# EasyEDA Pro project Frogduino R2 EasyedaPro.epro

# Board PCB6
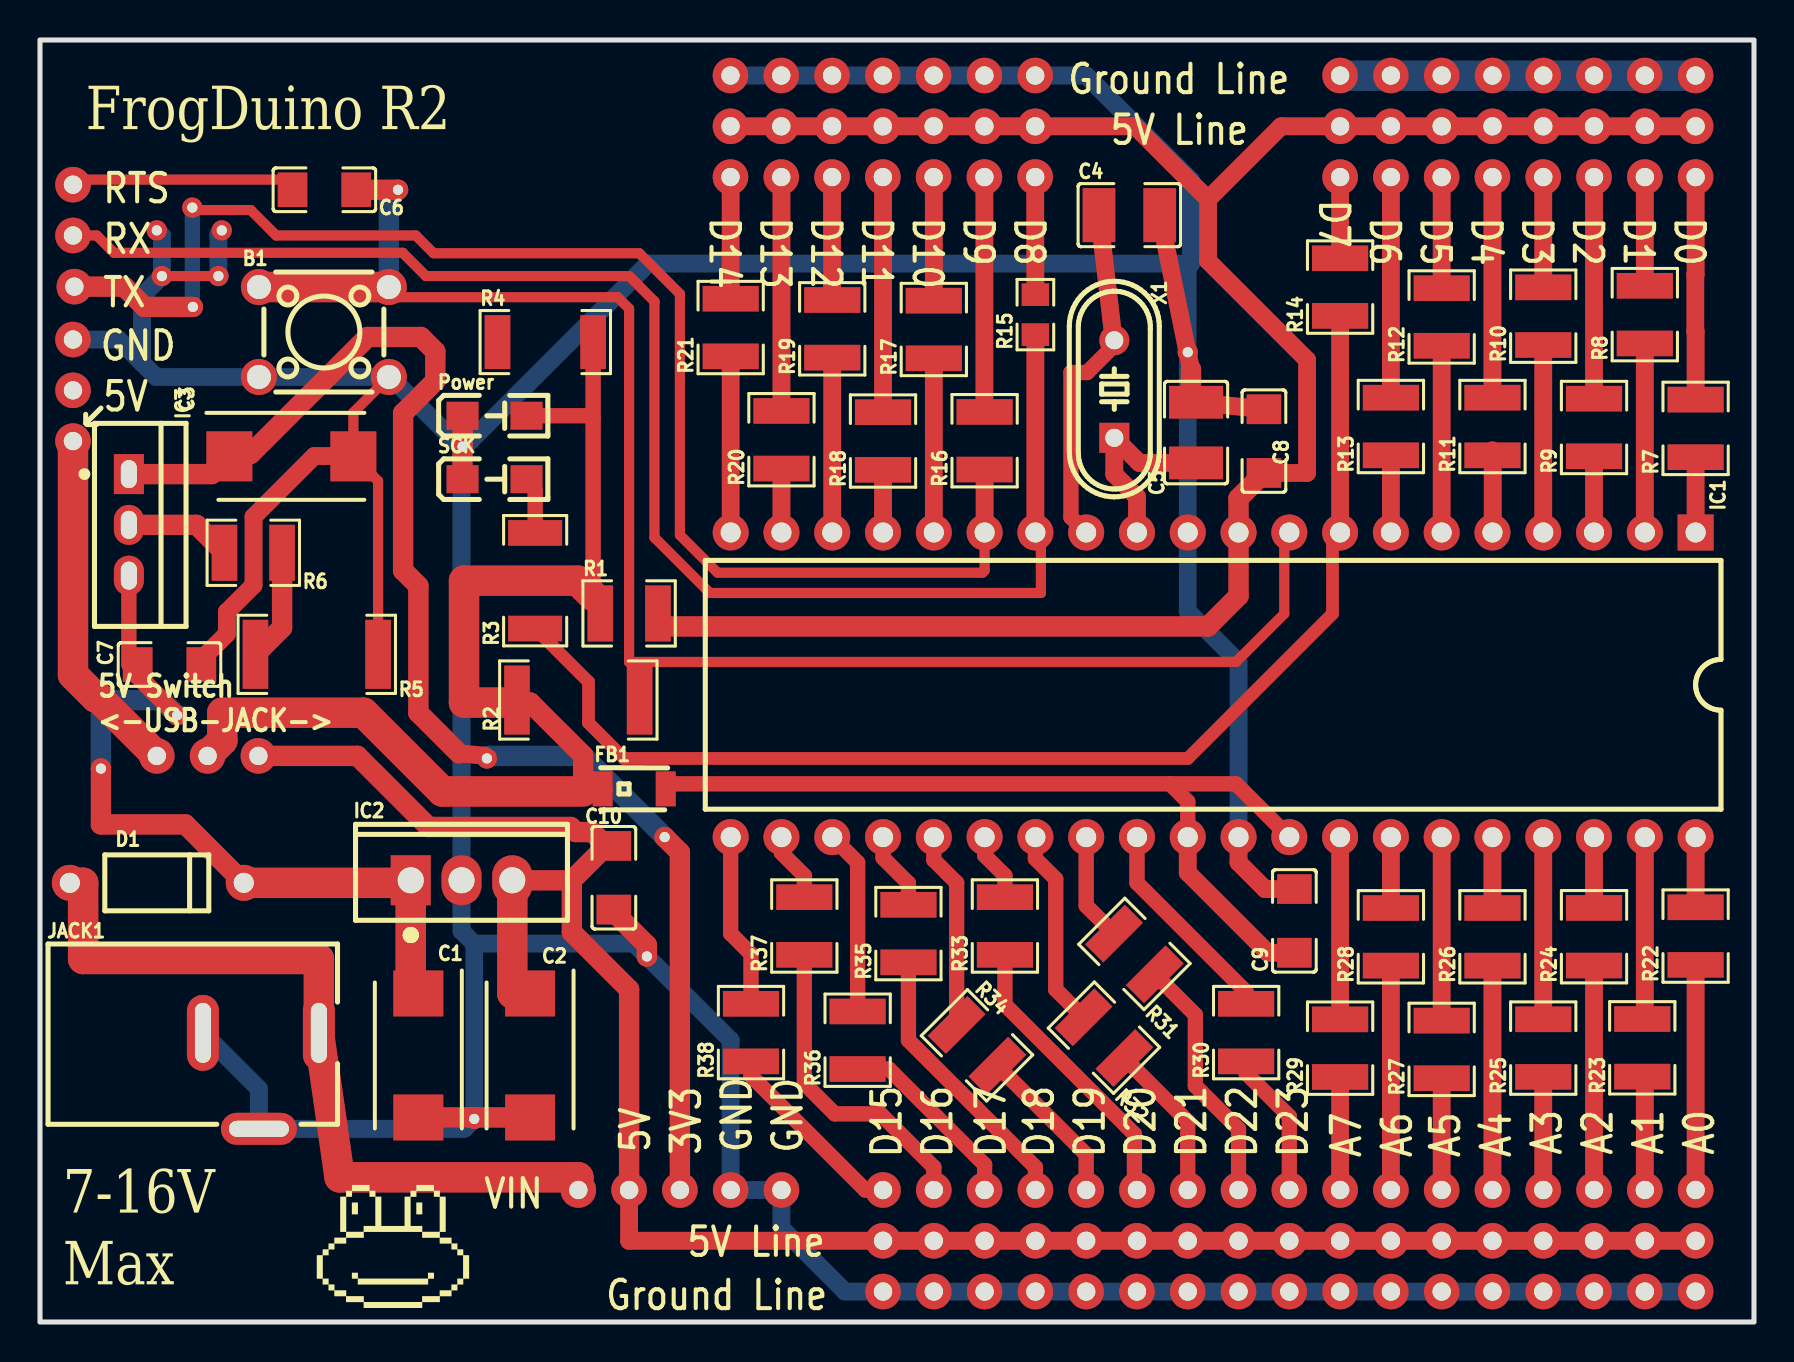
[diagram p0: board, top side]
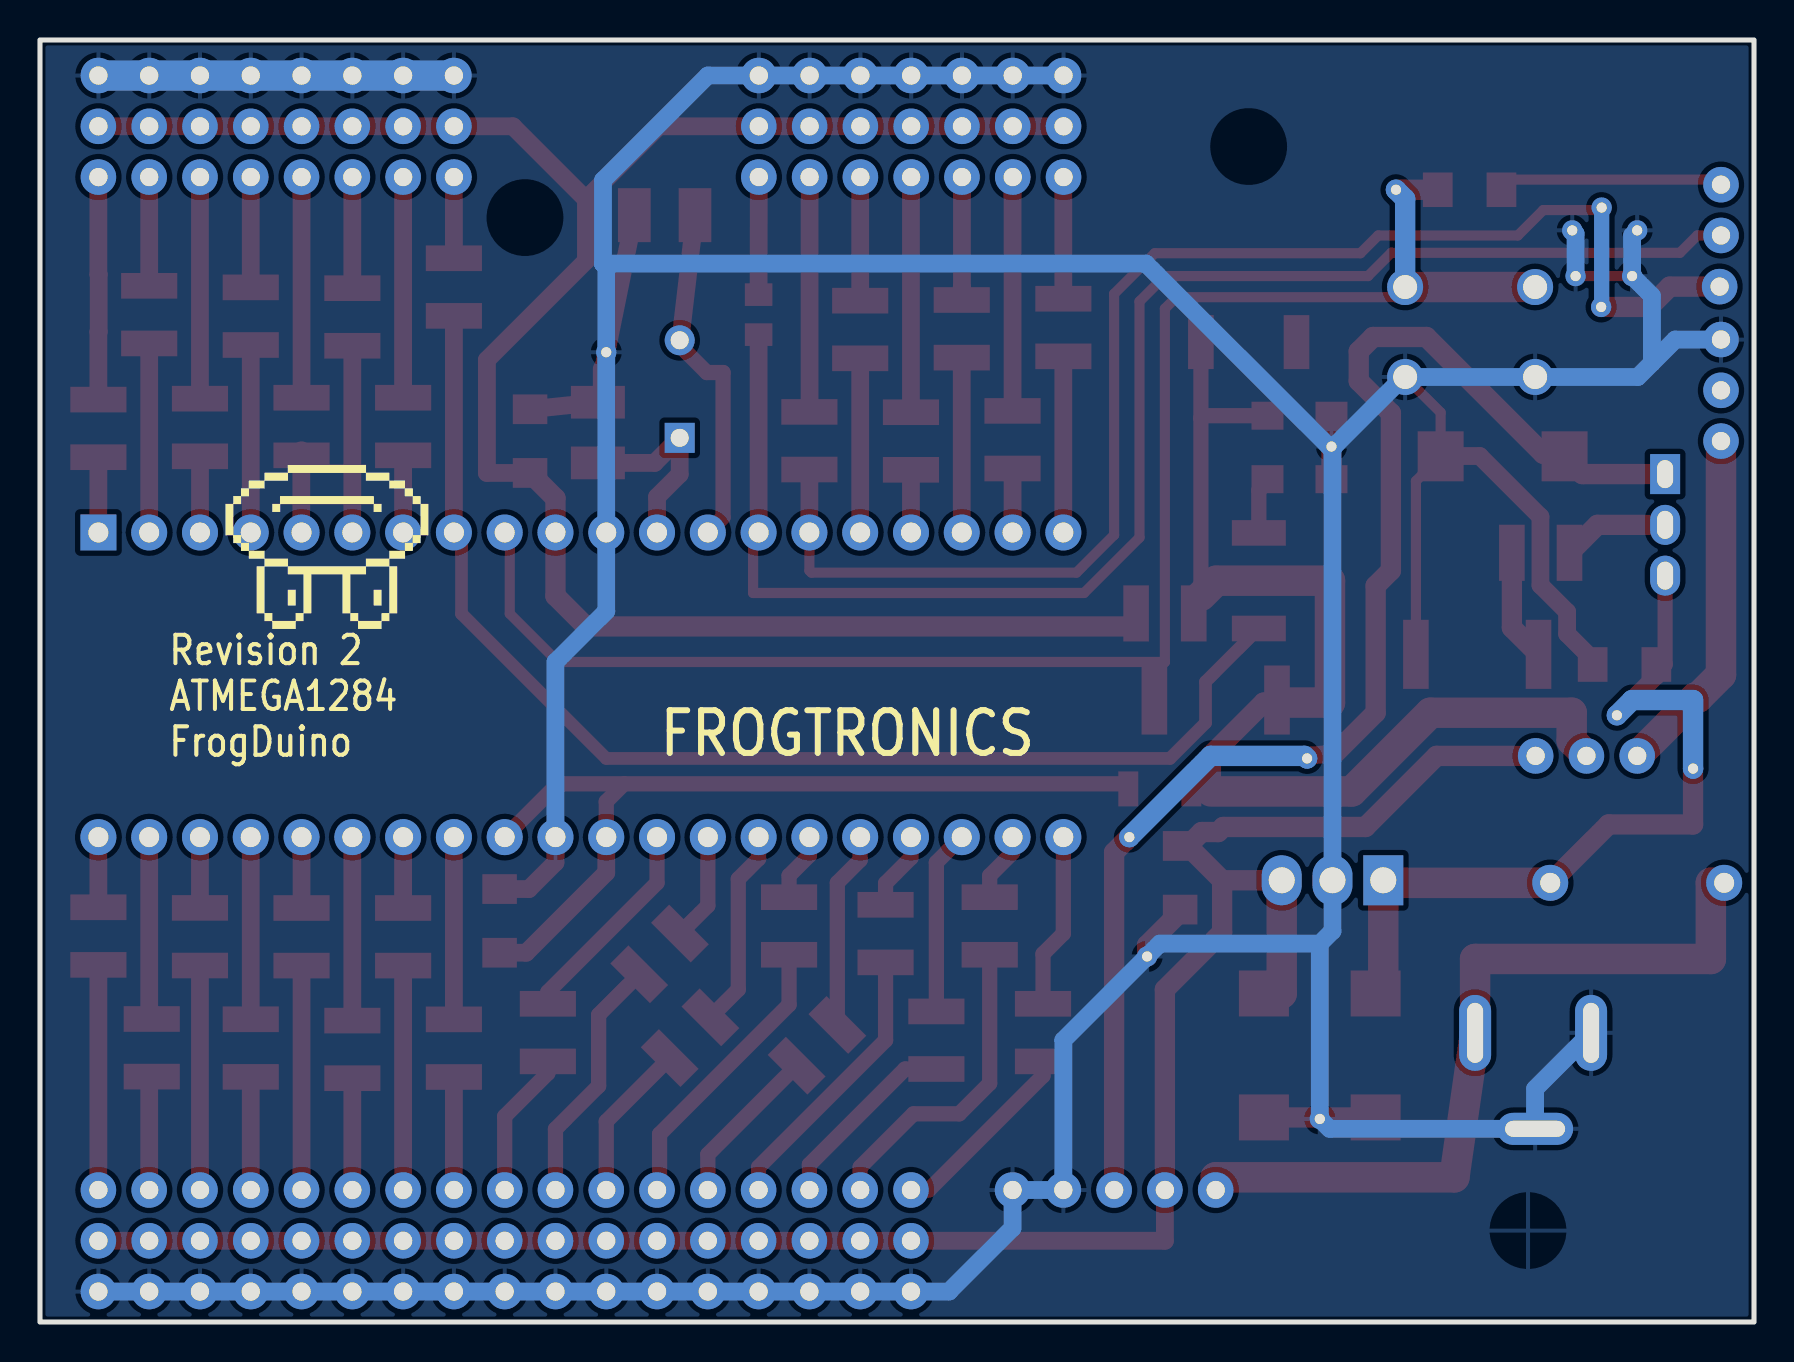
[diagram p1: board, bottom side, seen from below]

Outline 85.72 x 64.14 mm; copper layers: Top Layer, Bottom Layer. Coordinates in mm from the lower left corner of the outline.
Outline path: rectangle 0,64.14 85.72,0
Stack: Top Layer 0.035mm / Dielectric1 1.51mm FR4 er 4.5 / Bottom Layer 0.035mm

## Design rules (mm)
template: Custom Config
spacing copperThickness1oz (default): track to track 0.152, other pairs 0.152 to 0.3
spacing copperThickness2oz: track to track 0.203, other pairs 0.152 to 0.3
track width copperThickness1oz (default): min 0.254, default 0.508, max 5.08
track width copperThickness2oz: min 0.203, default 0.254, max 2.54
differential pair differentialPair (default): width min 0.127, default 0.254, max 2.54; gap min 0.152, default 0.152
via viaSize (default): diameter min 0.508, default 1.016, max 15.24; hole min 0.254, default 0.508, max 10.16

## Placement (name value [footprint] x y rotation side)
B1  TS02-66-43-BK-100-SCR-D  [SW-TH_4P-L6.0-W6.0-P4.50-LS6.5]  14.2 49.53 0 top
C1  -  [CAPPM7344X310N]  18.92 13.34 270 top
C2  -  [CAPPM7344X310N]  24.51 13.34 270 top
C3  -  [CAPPM7344X310N]  12.57 43.31 0 top
C4  C1210C220J5GACTU  [C1210]  54.48 55.37 0 top
C5  C1210C220J5GACTU  [C1210]  57.82 44.5 90 top
C6  100nF  [C1206]  14.22 56.64 180 top
C7  100nF  [C1206]  6.48 32.89 180 top
C8  100nF  [C1206]  61.21 44.07 90 top
C9  100nF  [C1206]  62.74 20.07 90 top
C10  100nF  [C1206]  28.7 22.23 90 top
D1  1N4007GP-E3/54  [DO-41_BD2.4-L4.7-P8.70-D0.9-RD]  5.84 21.97 180 top
FB1  2450AT18A100E  [ANT-SMD_L3.2-W1.6]  29.72 26.67 0 top
IC1  ATMEGA1284-PU  [PDIP-40_L52.3-W13.8-P2.54-LS15.2-BL]  58.67 31.88 180 top
IC2  LM7805L-TA3-T  [TO-220IS_L10.16-W4.7-P2.54-L]  21.08 22.1 0 top
IC3  LM317T/NOPB  [TO-220-3_L10.2-W4.6-P2.54-L]  4.44 39.88 270 top
JACK1  694106301002  [DC-IN-TH_694106301002]  11.05 12.06 0 top
NOREF  -  [Pad_e45]  72.64 6.6 0 top
NOREF#2  -  [Pad_e1856]  59.94 1.52 0 top
NOREF#3  -  [Pad_e342]  34.53 57.28 0 top
NOREF#4  -  [Pad_e10]  61.47 55.25 0 top
NOREF#5  -  [Pad_e1864]  80.26 1.52 0 top
NOREF#6  -  [Pad_e2012]  67.56 59.82 0 top
NOREF#7  -  [Pad_e1607]  7.64 50.78 0 top
NOREF#8  -  [Pad_e1837]  54.86 4.06 0 top
NOREF#9  -  [Pad_e59]  44.7 6.6 0 top
NOREF#10  -  [Pad_e1865]  82.8 1.52 0 top
NOREF#11  -  [Pad_e1612]  6.86 30.35 0 top
NOREF#12  -  [Pad_e339]  42.15 57.28 0 top
NOREF#13  -  [Pad_e12]  82.8 57.28 0 top
NOREF#14  -  [Pad_e1840]  62.48 4.06 0 top
NOREF#15  -  [Pad_e16]  72.64 57.28 0 top
NOREF#16  -  [Pad_e64]  29.46 6.6 0 top
NOREF#17  -  [Pad_e1853]  52.32 1.52 0 top
NOREF#18  -  [Pad_e723]  1.65 54.36 90 top
NOREF#19  -  [Pad_e1850]  44.7 1.52 0 top
NOREF#20  -  [Pad_e47]  77.72 6.6 0 top
NOREF#21  -  [Pad_e2019]  34.53 62.36 0 top
NOREF#22  -  [Pad_e1847]  80.26 4.06 0 top
NOREF#23  -  [Pad_e1602]  6.1 52.32 0 top
NOREF#24  -  [Pad_e62]  34.54 6.6 0 top
NOREF#25  -  [Pad_e1848]  82.8 4.06 0 top
NOREF#26  -  [Pad_e13]  80.26 57.28 0 top
NOREF#27  -  [Pad_e2014]  72.64 59.82 0 top
NOREF#28  -  [Pad_e18]  67.56 57.28 0 top
NOREF#29  -  [Pad_e60]  42.16 6.6 0 top
NOREF#30  -  [Pad_e1604]  9.09 54.61 0 top
NOREF#31  -  [Pad_e43]  70.1 6.6 0 top
NOREF#32  -  [Pad_e2010]  49.77 59.82 0 top
NOREF#33  -  [Pad_e2006]  39.61 59.82 0 top
NOREF#34  -  [Pad_e1835]  49.78 4.06 0 top
NOREF#35  -  [Pad_e1603]  5.84 54.61 0 top
NOREF#36  -  [Pad_e725]  1.65 56.9 90 top
NOREF#37  -  [Pad_e48]  80.26 6.6 0 top
NOREF#38  -  [Pad_e1852]  49.78 1.52 0 top
NOREF#39  -  [Pad_e1844]  72.64 4.06 0 top
NOREF#40  -  [Pad_e1859]  67.56 1.52 0 top
NOREF#41  -  [Pad_e57]  49.78 6.6 0 top
NOREF#42  -  [Pad_e1832]  42.16 4.06 0 top
NOREF#43  -  [Pad_e2021]  39.61 62.36 0 top
NOREF#44  -  [Pad_e2013]  70.1 59.82 0 top
NOREF#45  -  [Pad_e1843]  70.1 4.06 0 top
NOREF#46  -  [Pad_e3694]  11.3 4.57 0 top
NOREF#47  -  [Pad_e2011]  65.02 59.82 0 top
NOREF#48  -  [Pad_e1834]  47.24 4.06 0 top
NOREF#49  -  [Pad_e1838]  57.4 4.06 0 top
NOREF#50  -  [Pad_e1855]  57.4 1.52 0 top
NOREF#51  -  [Pad_e1849]  42.16 1.52 0 top
NOREF#52  -  [Pad_e1557]  57.4 48.51 0 top
NOREF#53  -  [Pad_e52]  62.48 6.6 0 top
NOREF#54  -  [Pad_e336]  49.77 57.28 0 top
NOREF#55  -  [Pad_e435]  5.84 28.32 90 top
NOREF#56  -  [Pad_e2029]  72.64 62.36 0 top
NOREF#57  -  [Pad_e17]  70.1 57.28 0 top
NOREF#58  -  [Pad_e676]  1.65 44.07 0 top
NOREF#59  -  [Pad_e2009]  47.23 59.82 0 top
NOREF#60  -  [Pad_e58]  47.24 6.6 0 top
NOREF#61  -  [Pad_e14]  77.72 57.28 0 top
NOREF#62  -  [Pad_e53]  59.94 6.6 0 top
NOREF#63  -  [Pad_e2032]  80.26 62.36 0 top
NOREF#64  -  [Pad_e63]  32 6.6 0 top
NOREF#65  -  [Pad_e46]  75.18 6.6 0 top
NOREF#66  -  [Pad_e291]  1.65 46.61 90 top
NOREF#67  -  [Pad_e2007]  42.15 59.82 0 top
NOREF#68  -  [Pad_e1845]  75.18 4.06 0 top
NOREF#69  -  [Pad_e19]  65.02 57.28 0 top
NOREF#70  -  [Pad_e340]  39.61 57.28 0 top
NOREF#71  -  [Pad_e1836]  52.32 4.06 0 top
NOREF#72  -  [Pad_e1621]  30.35 18.29 0 top
NOREF#73  -  [Pad_e1858]  65.02 1.52 0 top
NOREF#74  -  [Pad_e2031]  77.72 62.36 0 top
NOREF#75  -  [Pad_e1863]  77.72 1.52 0 top
NOREF#76  -  [Pad_e744]  1.72 51.8 90 top
NOREF#77  -  [Pad_e341]  37.07 57.28 0 top
NOREF#78  -  [Pad_e1609]  21.13 43.8 0 top
NOREF#79  -  [Pad_e54]  57.4 6.6 0 top
NOREF#80  -  [Pad_e1860]  70.1 1.52 0 top
NOREF#81  -  [Pad_e1861]  72.64 1.52 0 top
NOREF#82  -  [Pad_e41]  67.56 6.6 0 top
NOREF#83  -  [Pad_e433]  10.92 28.32 90 top
NOREF#84  -  [Pad_e2028]  70.1 62.36 0 top
NOREF#85  -  [Pad_e337]  47.23 57.28 0 top
NOREF#86  -  [Pad_e2030]  75.18 62.36 0 top
NOREF#87  -  [Pad_e2020]  37.07 62.36 0 top
NOREF#88  -  [Pad_e180]  25.27 58.8 0 top
NOREF#89  -  [Pad_e2033]  82.8 62.36 0 top
NOREF#90  -  [Pad_e2008]  44.69 59.82 0 top
NOREF#91  -  [Pad_e434]  8.38 28.32 90 top
NOREF#92  -  [Pad_e290]  1.65 49.15 90 top
NOREF#93  -  [Pad_e1614]  31.24 24.26 0 top
NOREF#94  -  [Pad_e1862]  75.18 1.52 0 top
NOREF#95  -  [Pad_e2017]  80.26 59.82 0 top
NOREF#96  -  [Pad_e1842]  67.56 4.06 0 top
NOREF#97  -  [Pad_e1606]  17.91 56.64 0 top
NOREF#98  -  [Pad_e2023]  44.69 62.36 0 top
NOREF#99  -  [Pad_e1623]  21.72 10.16 0 top
NOREF#100  -  [Pad_e38]  65.02 6.6 0 top
NOREF#101  -  [Pad_e2016]  77.72 59.82 0 top
NOREF#102  -  [Pad_e1605]  7.62 55.75 0 top
NOREF#103  -  [Pad_e1857]  62.48 1.52 0 top
NOREF#104  -  [Pad_e55]  54.86 6.6 0 top
NOREF#105  -  [Pad_e2024]  47.23 62.36 0 top
NOREF#106  -  [Pad_e2022]  42.15 62.36 0 top
NOREF#107  -  [Pad_e2018]  82.8 59.82 0 top
NOREF#108  -  [Pad_e1613]  3.05 27.69 0 top
NOREF#109  -  [Pad_e2026]  65.02 62.36 0 top
NOREF#110  -  [Pad_e15]  75.18 57.28 0 top
NOREF#111  -  [Pad_e1615]  22.35 28.19 0 top
NOREF#112  -  [Pad_e2004]  34.53 59.82 0 top
NOREF#113  -  [Pad_e1854]  54.86 1.52 0 top
NOREF#114  -  [Pad_e1841]  65.02 4.06 0 top
NOREF#115  -  [Pad_e56]  52.32 6.6 0 top
NOREF#116  -  [Pad_e1601]  8.92 52.32 0 top
NOREF#117  -  [Pad_e338]  44.69 57.28 0 top
NOREF#118  -  [Pad_e2005]  37.07 59.82 0 top
NOREF#119  -  [Pad_e2027]  67.56 62.36 0 top
NOREF#120  -  [Pad_e1851]  47.24 1.52 0 top
NOREF#121  -  [Pad_e1846]  77.72 4.06 0 top
NOREF#122  -  [Pad_e2025]  49.77 62.36 0 top
NOREF#123  -  [Pad_e1839]  59.94 4.06 0 top
NOREF#124  -  [Pad_e61]  37.08 6.6 0 top
NOREF#125  -  [Pad_e1833]  44.7 4.06 0 top
NOREF#126  -  [Pad_e65]  26.92 6.6 0 top
NOREF#127  -  [Pad_e49]  82.8 6.6 0 top
NOREF#128  -  [Pad_e2015]  75.18 59.82 0 top
Power  SML-811UTT86C  [LED-SMD_L3.4-W1.3-RD]  22.73 45.34 0 top
R1  0Ω  [R1210]  29.46 35.45 0 top
R2  10kΩ  [R2512]  26.92 31.12 0 top
R3  330Ω  [R2010]  24.76 37.08 90 top
R4  330Ω  [R2010]  25.27 49.02 0 top
R5  390Ω  [R2512]  13.84 33.4 180 top
R6  240Ω  [R1210]  10.67 38.48 180 top
R7  240Ω  [R1210]  82.8 44.7 90 top
R8  240Ω  [R1210]  80.26 50.4 90 top
R9  240Ω  [R1210]  77.72 44.75 90 top
R10  240Ω  [R1210]  75.18 50.32 90 top
R11  240Ω  [R1210]  72.64 44.8 90 top
R12  240Ω  [R1210]  70.1 50.28 90 top
R13  240Ω  [R1210]  67.56 44.8 90 top
R14  240Ω  [R1210]  65.02 51.78 90 top
R15  240Ω  [R0805]  49.78 50.4 90 top
R16  240Ω  [R1210]  47.24 44.09 90 top
R17  240Ω  [R1210]  44.7 49.65 90 top
R18  240Ω  [R1210]  42.16 44.07 90 top
R19  240Ω  [R1210]  39.62 49.68 90 top
R20  240Ω  [R1210]  37.08 44.14 90 top
R21  240Ω  [R1210]  34.54 49.75 90 top
R22  240Ω  [R1210]  82.8 19.31 90 top
R23  240Ω  [R1210]  80.14 13.72 90 top
R24  240Ω  [R1210]  77.72 19.27 90 top
R25  240Ω  [R1210]  75.18 13.7 90 top
R26  240Ω  [R1210]  72.64 19.27 90 top
R27  240Ω  [R1210]  70.1 13.64 90 top
R28  240Ω  [R1210]  67.56 19.27 90 top
R29  240Ω  [R1210]  65.02 13.7 90 top
R30  240Ω  [R1210]  60.32 14.48 90 top
R31  240Ω  [R1210]  54.74 18.42 135 top
R32  240Ω  [R1210]  53.21 14.22 135 top
R33  240Ω  [R1210]  48.26 19.81 90 top
R34  240Ω  [R1210]  46.86 13.84 135 top
R35  240Ω  [R1210]  43.43 19.43 90 top
R36  240Ω  [R1210]  40.89 14.1 90 top
R37  240Ω  [R1210]  38.23 19.81 90 top
R38  240Ω  [R1210]  35.56 14.48 90 top
SCK  SML-811UTT86C  [LED-SMD_L3.4-W1.3-RD]  22.73 42.16 0 top
X1  16MHz  [HC-49US_L11.5-W4.5-P4.88]  53.73 46.67 90 top

## Footprints (pads in the part's own frame, mm; a bottom-side part is the same pattern mirrored in y, then rotated)
ANT-SMD_L3.2-W1.6
  rect 1x1.75 smd: 1(-1.578,0) 2(1.578,0)
C1206
  rect 1.485x1.728 smd: 1(-1.593,0) 2(1.593,0)
C1210
  rect 1.635x2.7 smd: 1(-1.518,0) 2(1.518,0)
CAPPM7344X310N
  rect 2.3x2.5 smd: 1(-3.1,0) 2(3.1,0)
DC-IN-TH_694106301002
  oval 1.6x3.8 hole 0.8x3: 1(2.9,2.4) 2(-2.9,2.4)
  oval 3.8x1.6 hole 3x0.8: 3(-0.1,-2.4)
DO-41_BD2.4-L4.7-P8.70-D0.9-RD
  round 1.8 hole 1: 1(-4.35,0) 2(4.35,0)
HC-49US_L11.5-W4.5-P4.88
  rect 1.5x1.5 hole 0.9: 1(-2.44,0)
  round 1.5 hole 0.9: 2(2.44,0)
LED-SMD_L3.4-W1.3-RD
  rect 1.6x1.4 smd: 1(-1.6,0) 2(1.6,0)
Pad_e10
  round 0.003 hole 3.302: 1(0,0)
Pad_e12
  round 1.778 hole 0.914: 1(0,0)
Pad_e13
  round 1.778 hole 0.914: 2(0,0)
Pad_e14
  round 1.778 hole 0.914: 3(0,0)
Pad_e15
  round 1.778 hole 0.914: 4(0,0)
Pad_e16
  round 1.778 hole 0.914: 5(0,0)
Pad_e17
  round 1.778 hole 0.914: 6(0,0)
Pad_e18
  round 1.778 hole 0.914: 7(0,0)
Pad_e19
  round 1.778 hole 0.914: 8(0,0)
Pad_e38
  round 1.778 hole 0.914: 1(0,0)
Pad_e41
  round 1.778 hole 0.914: 2(0,0)
Pad_e43
  round 1.778 hole 0.914: 3(0,0)
Pad_e45
  round 1.778 hole 0.914: 4(0,0)
Pad_e46
  round 1.778 hole 0.914: 5(0,0)
Pad_e47
  round 1.778 hole 0.914: 6(0,0)
Pad_e48
  round 1.778 hole 0.914: 7(0,0)
Pad_e49
  round 1.778 hole 0.914: 8(0,0)
Pad_e52
  round 1.778 hole 0.914: 1(0,0)
Pad_e53
  round 1.778 hole 0.914: 2(0,0)
Pad_e54
  round 1.778 hole 0.914: 3(0,0)
Pad_e55
  round 1.778 hole 0.914: 4(0,0)
Pad_e56
  round 1.778 hole 0.914: 5(0,0)
Pad_e57
  round 1.778 hole 0.914: 6(0,0)
Pad_e58
  round 1.778 hole 0.914: 7(0,0)
Pad_e59
  round 1.778 hole 0.914: 8(0,0)
Pad_e60
  round 1.778 hole 0.914: 9(0,0)
Pad_e61
  round 1.778 hole 0.914: GND(0,0)
Pad_e62
  round 1.778 hole 0.914: GND(0,0)
Pad_e63
  round 1.778 hole 0.914: 3V3(0,0)
Pad_e64
  round 1.778 hole 0.914: 5V(0,0)
Pad_e65
  round 1.778 hole 0.914: VIN(0,0)
Pad_e180
  round 0.003 hole 3.302: 1(0,0)
Pad_e290
  round 1.778 hole 0.914: GND(0,0)
Pad_e291
  round 1.778 hole 0.914: NC(0,0)
Pad_e336
  round 1.778 hole 0.914: 9(0,0)
Pad_e337
  round 1.778 hole 0.914: 10(0,0)
Pad_e338
  round 1.778 hole 0.914: 11(0,0)
Pad_e339
  round 1.778 hole 0.914: 12(0,0)
Pad_e340
  round 1.778 hole 0.914: 13(0,0)
Pad_e341
  round 1.778 hole 0.914: 14(0,0)
Pad_e342
  round 1.778 hole 0.914: 15(0,0)
Pad_e433
  round 1.778 hole 0.914: 1(0,0)
Pad_e434
  round 1.778 hole 0.914: 2(0,0)
Pad_e435
  round 1.778 hole 0.914: 3(0,0)
Pad_e676
  round 1.778 hole 0.914: 1(0,0)
Pad_e723
  round 1.778 hole 0.914: RX(0,0)
Pad_e725
  round 1.778 hole 0.914: RTS(0,0)
Pad_e744
  round 1.778 hole 0.914: TX(0,0)
Pad_e1557
  round 1.016 hole 0.508: TP1(0,0)
Pad_e1601
  round 1.016 hole 0.508: TP1(0,0)
Pad_e1602
  round 1.016 hole 0.508: TP1(0,0)
Pad_e1603
  round 1.016 hole 0.508: TP1(0,0)
Pad_e1604
  round 1.016 hole 0.508: TP1(0,0)
Pad_e1605
  round 1.016 hole 0.508: TP1(0,0)
Pad_e1606
  round 1.016 hole 0.508: TP1(0,0)
Pad_e1607
  round 1.016 hole 0.508: TP1(0,0)
Pad_e1609
  round 1.016 hole 0.508: TP1(0,0)
Pad_e1612
  round 1.016 hole 0.508: TP1(0,0)
Pad_e1613
  round 1.016 hole 0.508: TP1(0,0)
Pad_e1614
  round 1.016 hole 0.508: TP1(0,0)
Pad_e1615
  round 1.016 hole 0.508: TP1(0,0)
Pad_e1621
  round 1.016 hole 0.508: TP1(0,0)
Pad_e1623
  round 1.016 hole 0.508: TP1(0,0)
Pad_e1832
  round 1.778 hole 0.914: 9(0,0)
Pad_e1833
  round 1.778 hole 0.914: 8(0,0)
Pad_e1834
  round 1.778 hole 0.914: 7(0,0)
Pad_e1835
  round 1.778 hole 0.914: 6(0,0)
Pad_e1836
  round 1.778 hole 0.914: 5(0,0)
Pad_e1837
  round 1.778 hole 0.914: 4(0,0)
Pad_e1838
  round 1.778 hole 0.914: 3(0,0)
Pad_e1839
  round 1.778 hole 0.914: 2(0,0)
Pad_e1840
  round 1.778 hole 0.914: 1(0,0)
Pad_e1841
  round 1.778 hole 0.914: 1(0,0)
Pad_e1842
  round 1.778 hole 0.914: 2(0,0)
Pad_e1843
  round 1.778 hole 0.914: 3(0,0)
Pad_e1844
  round 1.778 hole 0.914: 4(0,0)
Pad_e1845
  round 1.778 hole 0.914: 5(0,0)
Pad_e1846
  round 1.778 hole 0.914: 6(0,0)
Pad_e1847
  round 1.778 hole 0.914: 7(0,0)
Pad_e1848
  round 1.778 hole 0.914: 8(0,0)
Pad_e1849
  round 1.778 hole 0.914: 9(0,0)
Pad_e1850
  round 1.778 hole 0.914: 8(0,0)
Pad_e1851
  round 1.778 hole 0.914: 7(0,0)
Pad_e1852
  round 1.778 hole 0.914: 6(0,0)
Pad_e1853
  round 1.778 hole 0.914: 5(0,0)
Pad_e1854
  round 1.778 hole 0.914: 4(0,0)
Pad_e1855
  round 1.778 hole 0.914: 3(0,0)
Pad_e1856
  round 1.778 hole 0.914: 2(0,0)
Pad_e1857
  round 1.778 hole 0.914: 1(0,0)
Pad_e1858
  round 1.778 hole 0.914: 1(0,0)
Pad_e1859
  round 1.778 hole 0.914: 2(0,0)
Pad_e1860
  round 1.778 hole 0.914: 3(0,0)
Pad_e1861
  round 1.778 hole 0.914: 4(0,0)
Pad_e1862
  round 1.778 hole 0.914: 5(0,0)
Pad_e1863
  round 1.778 hole 0.914: 6(0,0)
Pad_e1864
  round 1.778 hole 0.914: 7(0,0)
Pad_e1865
  round 1.778 hole 0.914: 8(0,0)
Pad_e2004
  round 1.778 hole 0.914: 15(0,0)
Pad_e2005
  round 1.778 hole 0.914: 14(0,0)
Pad_e2006
  round 1.778 hole 0.914: 13(0,0)
Pad_e2007
  round 1.778 hole 0.914: 12(0,0)
Pad_e2008
  round 1.778 hole 0.914: 11(0,0)
Pad_e2009
  round 1.778 hole 0.914: 10(0,0)
Pad_e2010
  round 1.778 hole 0.914: 9(0,0)
Pad_e2011
  round 1.778 hole 0.914: 8(0,0)
Pad_e2012
  round 1.778 hole 0.914: 7(0,0)
Pad_e2013
  round 1.778 hole 0.914: 6(0,0)
Pad_e2014
  round 1.778 hole 0.914: 5(0,0)
Pad_e2015
  round 1.778 hole 0.914: 4(0,0)
Pad_e2016
  round 1.778 hole 0.914: 3(0,0)
Pad_e2017
  round 1.778 hole 0.914: 2(0,0)
Pad_e2018
  round 1.778 hole 0.914: 1(0,0)
Pad_e2019
  round 1.778 hole 0.914: 15(0,0)
Pad_e2020
  round 1.778 hole 0.914: 14(0,0)
Pad_e2021
  round 1.778 hole 0.914: 13(0,0)
Pad_e2022
  round 1.778 hole 0.914: 12(0,0)
Pad_e2023
  round 1.778 hole 0.914: 11(0,0)
Pad_e2024
  round 1.778 hole 0.914: 10(0,0)
Pad_e2025
  round 1.778 hole 0.914: 9(0,0)
Pad_e2026
  round 1.778 hole 0.914: 8(0,0)
Pad_e2027
  round 1.778 hole 0.914: 7(0,0)
Pad_e2028
  round 1.778 hole 0.914: 6(0,0)
Pad_e2029
  round 1.778 hole 0.914: 5(0,0)
Pad_e2030
  round 1.778 hole 0.914: 4(0,0)
Pad_e2031
  round 1.778 hole 0.914: 3(0,0)
Pad_e2032
  round 1.778 hole 0.914: 2(0,0)
Pad_e2033
  round 1.778 hole 0.914: 1(0,0)
Pad_e3694
  round 0.003 hole 3.302: 1(0,0)
PDIP-40_L52.3-W13.8-P2.54-LS15.2-BL
  rect 1.8x1.8 hole 1: 1(-24.13,-7.62)
  round 1.8 hole 1: 2(-21.59,-7.62) 3(-19.05,-7.62) 4(-16.51,-7.62) 5(-13.97,-7.62) 6(-11.43,-7.62) 7(-8.89,-7.62) 8(-6.35,-7.62) 9(-3.81,-7.62) 10(-1.27,-7.62) 11(1.27,-7.62) 12(3.81,-7.62) 13(6.35,-7.62) 14(8.89,-7.62) 15(11.43,-7.62) 16(13.97,-7.62) 17(16.51,-7.62) 18(19.05,-7.62) 19(21.59,-7.62) 20(24.13,-7.62) 21(24.13,7.62) 22(21.59,7.62) 23(19.05,7.62) 24(16.51,7.62) 25(13.97,7.62) 26(11.43,7.62) 27(8.89,7.62) 28(6.35,7.62) 29(3.81,7.62) 30(1.27,7.62) 31(-1.27,7.62) 32(-3.81,7.62) 33(-6.35,7.62) 34(-8.89,7.62) 35(-11.43,7.62) 36(-13.97,7.62) 37(-16.51,7.62) 38(-19.05,7.62) 39(-21.59,7.62) 40(-24.13,7.62)
R0805
  rect 1.133x1.377 smd: 1(-1,0) 2(1,0)
R1210
  rect 1.282x2.808 smd: 1(-1.441,0) 2(1.441,0)
R2010
  rect 1.282x2.7 smd: 1(-2.391,0) 2(2.391,0)
R2512
  rect 1.282x3.456 smd: 1(-3.067,0) 2(3.067,0)
SW-TH_4P-L6.0-W6.0-P4.50-LS6.5
  round 1.8 hole 1.2: 1(-3.25,2.25) 2(3.25,2.25) 3(-3.25,-2.25) 4(3.25,-2.25)
TO-220-3_L10.2-W4.6-P2.54-L
  rect 2x1.5 hole 1.4x0.8: 1(-2.54,0)
  oval 2x1.5 hole 1.4x0.8: 2(0,0) 3(2.54,0)
TO-220IS_L10.16-W4.7-P2.54-L
  rect 2x2.5 hole 1.3: 1(-2.54,0)
  oval 2x2.5 hole 1.3: 2(0,0) 3(2.54,0)

## Nets
3V3: C3.1 IC3.1 NOREF#64.3V3 NOREF#93.TP1 NOREF#111.TP1
5VUSB: NOREF#55.3 NOREF#58.1
VCC: C8.1 C9.1 FB1.1 FB1.2 IC1.10 IC1.30 IC1.32 NOREF#6.7 NOREF#27.5 NOREF#32.9 NOREF#33.13 NOREF#44.6 NOREF#47.8 NOREF#59.10 NOREF#67.12 NOREF#90.11 NOREF#91.2 NOREF#95.2 NOREF#101.3 NOREF#107.1 NOREF#112.15 NOREF#118.14 NOREF#128.4 Power.2 R1.1 R1.2 R2.1 R4.2
GROUND: B1.3 B1.4 C1.2 C2.2 C3.2 C4.2 C5.2 C7.1 C8.2 C9.2 C10.1 IC1.11 IC1.31 IC2.2 JACK1.2 JACK1.3 NOREF#2.2 NOREF#5.7 NOREF#10.8 NOREF#17.5 NOREF#19.8 NOREF#21.15 NOREF#23.TP1 NOREF#24.GND NOREF#30.TP1 NOREF#35.TP1 NOREF#38.6 NOREF#40.2 NOREF#43.13 NOREF#46.1 NOREF#50.3 NOREF#51.9 NOREF#52.TP1 NOREF#56.5 NOREF#63.2 NOREF#72.TP1 NOREF#73.1 NOREF#74.3 NOREF#75.6 NOREF#78.TP1 NOREF#80.3 NOREF#81.4 NOREF#84.6 NOREF#86.4 NOREF#87.14 NOREF#89.1 NOREF#92.GND NOREF#94.5 NOREF#98.11 NOREF#99.TP1 NOREF#103.1 NOREF#105.10 NOREF#106.12 NOREF#109.8 NOREF#113.4 NOREF#116.TP1 NOREF#119.7 NOREF#120.7 NOREF#122.9 NOREF#124.GND Power.1 R5.1 SCK.1

Pads without a net: B1 1 2; C1 1; C2 1; C4 1; C5 1; C6 1 2; C7 2; C10 2; D1 1 2; IC1 1 2 3 4 5 6 7 8 9 12 13 14 15 16 17 18 19 20 21 22 23 24 25 26 27 28 29 33 34 35 36 37 38 39 40; IC2 1 3; IC3 2 3; JACK1 1; NOREF 4; NOREF#3 15; NOREF#4 1; NOREF#7 TP1; NOREF#8 4; NOREF#9 8; NOREF#11 TP1; NOREF#12 12; NOREF#13 1; NOREF#14 1; NOREF#15 5; NOREF#16 5V; NOREF#18 RX; NOREF#20 6; NOREF#22 7; NOREF#25 8; NOREF#26 2; NOREF#28 7; NOREF#29 9; NOREF#31 3; NOREF#34 6; NOREF#36 RTS; NOREF#37 7; NOREF#39 4; NOREF#41 6; NOREF#42 9; NOREF#45 3; NOREF#48 7; NOREF#49 3; NOREF#53 1; NOREF#54 9; NOREF#57 6; NOREF#60 7; NOREF#61 3; NOREF#62 2; NOREF#65 5; NOREF#66 NC; NOREF#68 5; NOREF#69 8; NOREF#70 13; NOREF#71 5; NOREF#76 TX; NOREF#77 14; NOREF#79 3; NOREF#82 2; NOREF#83 1; NOREF#85 10; NOREF#88 1; NOREF#96 2; NOREF#97 TP1; NOREF#100 1; NOREF#102 TP1; NOREF#104 4; NOREF#108 TP1; NOREF#110 4; NOREF#114 1; NOREF#115 5; NOREF#117 11; NOREF#121 6; NOREF#123 2; NOREF#125 8; NOREF#126 VIN; NOREF#127 8; R2 2; R3 1 2; R4 1; R5 2; R6 1 2; R7 1 2; R8 1 2; R9 1 2; R10 1 2; R11 1 2; R12 1 2; R13 1 2; R14 1 2; R15 1 2; R16 1 2; R17 1 2; R18 1 2; R19 1 2; R20 1 2; R21 1 2; R22 1 2; R23 1 2; R24 1 2; R25 1 2; R26 1 2; R27 1 2; R28 1 2; R29 1 2; R30 1 2; R31 1 2; R32 1 2; R33 1 2; R34 1 2; R35 1 2; R36 1 2; R37 1 2; R38 1 2; SCK 2; X1 1 2

## Routing (per net, layer and track width the routed paths; a pad name or vN(x,y) marks a point on that pad's centre or on a via; arc(x,y) is an arc through that point)
3V3: length 70.5
  Top Layer w0.889: 20.95,28.45 22.24,28.33 NOREF#111.TP1
  Top Layer w1.016: NOREF#93.TP1 32,23.5 NOREF#64.3V3 ; 20.95,28.45 18.92,30.48 18.92,36.83 18.16,37.59 18.16,45.47 19.77,47.07 19.77,48.56 19.05,49.28 16.38,49.28 10.54,43.43 9.6,43.43 C3.1 8.58,42.42 4.44,42.42
  Bottom Layer w1.016: NOREF#93.TP1 27.18,28.32 22.48,28.32 NOREF#111.TP1
5VUSB: length 17.6
  Top Layer w1.524: NOREF#58.1 1.65,32.39 2.79,31.24 2.92,31.24 NOREF#55.3
VCC: length 211.4
  Top Layer w0.762: 56.51,26.92 57.4,26.04 IC1.30 ; 56.51,26.92 31.55,26.92 FB1.2 ; 56.51,26.92 59.82,26.92 IC1.32 ; 27.66,45.21 27.66,36.32 ; 27.66,45.21 27.54,45.34 Power.2 ; 27.66,45.21 R4.2 ; R1.1 28.02,36.07
  Top Layer w0.889: 58.42,56.16 54.77,59.82 NOREF#32.9 NOREF#59.10 NOREF#90.11 NOREF#67.12 NOREF#33.13 NOREF#118.14 NOREF#112.15 ; 58.42,56.16 58.42,53.08 63.37,48.13 63.37,42.48 C8.1 ; 58.42,56.16 62.07,59.82 NOREF#47.8 NOREF#6.7 NOREF#44.6 NOREF#27.5 NOREF#128.4 NOREF#101.3 NOREF#95.2 NOREF#107.1 ; IC1.30 57.4,22.48 61.41,18.47 C9.1
  Top Layer w1.016: FB1.1 28.01,26.54 27.16,26.54 27.16,28.35 24.52,30.99 23.22,30.99 ; 30.97,35.05 31.22,34.8 58.42,34.8 59.94,36.32 IC1.10 59.94,41.21 C8.1
  Top Layer w1.524: 27.66,36.32 26.9,37.08 21.21,37.08 21.21,30.99 23.22,30.99 ; 27.16,26.54 20.12,26.54 16.18,30.48 9.12,30.48 9.12,29.09 8.38,28.35 NOREF#91.2
(no net): length 1011.3
  Top Layer w0.508: 29.46,33.02 29.46,50.7 28.89,51.27 17.96,51.27 B1.2 ; 29.46,33.02 29.99,32.49 R2.2 ; 29.46,33.02 59.82,33.02 62.23,35.43 62.23,39.24 IC1.9 ; NOREF#36.RTS 1.9,57.15 12.12,57.15 C6.2 ; NOREF#18.RX 2.84,54.36 3.7,53.49 18.14,53.49 19.3,52.32 29.46,52.32 30.73,51.05 30.73,39.24 33.51,36.47 50.06,36.47 50.06,39.22 IC1.14 ; NOREF#102.TP1 7.74,55.63 10.54,55.63 11.81,54.36 18.8,54.36 19.68,53.47 29.97,53.47 32,51.44 32,39.37 33.89,37.49 47.14,37.49 47.24,37.59 IC1.15
  Top Layer w0.635: IC1.8 64.64,39.12 64.64,35.43 57.4,28.19 29.21,28.19 27.43,29.97 27.43,32.03 R3.1
  Top Layer w0.762: IC1.27 49.78,23.18 50.8,22.16 50.8,16.64 R32.2 ; IC3.3 4.44,32.89 C7.2 ; NOREF#41.6 49.78,7.75 43.43,14.1 R35.1 ; R36.2 40.89,22.99 IC1.23 ; IC1.21 34.54,19.43 35.56,18.42 R38.2 ; R31.1 57.78,15.37 57.78,11.81 59.94,9.65 NOREF#62.2 ; NOREF#29.9 41.28,6.6 35.56,12.32 R38.1 ; R36.1 42.46,12.66 47.24,7.87 NOREF#60.7 ; NOREF#104.4 54.74,6.73 54.74,9.4 48.26,15.88 R33.1 ; R30.1 60.32,12.45 62.48,10.29 NOREF#53.1 ; R37.2 38.23,22.33 37.08,23.47 IC1.22 ; IC1.25 44.7,23.11 45.85,21.97 45.85,14.86 R34.2 ; IC1.29 54.86,21.97 60.32,16.51 R30.2 ; R37.1 38.23,11.94 39.75,10.41 42.04,10.41 44.7,7.75 NOREF#9.8 ; 53.73,48.86 52.37,47.5 51.56,47.5 51.56,40.26 IC1.13 ; 24.76,39.35 24.76,41.61 24.33,42.04 ; NOREF#79.3 57.4,10.03 R32.1 ; R34.1 52.32,8.38 NOREF#115.5 ; R33.2 48.26,22.33 47.24,23.35 IC1.26 ; IC1.28 52.32,20.83 R31.2 ; R35.2 43.43,21.95 42.16,23.22 IC1.24
  Top Layer w0.889: NOREF#117.11 44.7,57.27 R17.2 ; IC1.40 R22.2 ; IC1.12 54.86,41.28 53.73,42.41 X1.1 54.99,42.98 C5.1 ; NOREF#85.10 47.23,45.54 R16.2 ; R12.1 IC1.6 ; R18.2 42.16,57.27 NOREF#12.12 ; R20.2 37.08,57.27 NOREF#77.14 ; IC1.19 R20.1 ; 77.72,39.5 77.72,43.31 ; 72.64,43.61 R11.1 72.66,43.35 72.66,39.51 IC1.5 ; IC1.33 R29.2 ; IC1.20 R21.1 ; NOREF#3.15 34.54,57.27 R21.2 ; IC1.18 R19.1 ; IC1.17 R18.1 ; R13.2 NOREF#28.7 ; R22.1 NOREF#127.8 ; IC1.39 80.26,15.62 80.14,15.49 R23.2 ; IC1.8 65.02,49.7 ; 75.18,12.26 NOREF#65.5 ; NOREF#13.1 82.8,52.41 82.79,52.4 82.79,49.55 82.8,49.53 R7.2 ; NOREF#37.7 80.26,12.15 R23.1 ; R9.2 NOREF#61.3 ; R14.2 NOREF#69.8 ; C7.2 4.88,32.33 NOREF#11.TP1 ; R10.2 NOREF#110.4 ; IC1.7 R13.1 ; IC1.38 R24.2 ; R11.2 NOREF#15.5 ; NOREF#16.5V 29.46,4.06 NOREF#42.9 NOREF#125.8 NOREF#48.7 NOREF#34.6 NOREF#71.5 NOREF#8.4 NOREF#49.3 NOREF#123.2 NOREF#14.1 NOREF#114.1 NOREF#96.2 NOREF#45.3 NOREF#39.4 NOREF#68.5 NOREF#121.6 NOREF#22.7 NOREF#25.8 ; R19.2 39.62,51.76 39.61,51.77 NOREF#70.13 ; R12.2 NOREF#57.6 ; R8.2 NOREF#26.2 ; R29.1 NOREF#100.1 ; 49.78,51.84 NOREF#54.9 ; IC1.34 R28.2 ; IC1.15 R16.1 ; R8.1 IC1.2 ; R26.1 NOREF.4 ; R17.1 IC1.16 ; R27.1 NOREF#31.3 ; IC1.37 R25.2 ; R24.1 NOREF#20.6 ; IC1.1 R7.1 ; 53.73,48.86 C4.1 ; 49.78,48.95 IC1.14 ; R10.1 IC1.4 ; IC1.35 R27.2 ; IC1.36 R26.2 ; R28.1 NOREF#82.2
  Top Layer w1.016: IC2.3 26.6,22.1 ; 26.6,22.1 28.32,23.82 27.63,24.51 26.8,24.51 26.54,24.77 19.43,24.77 15.88,28.32 NOREF#83.1 ; 26.6,22.1 26.6,19.5 29.46,16.64 NOREF#16.5V ; R6.1 12.11,34.73 R5.2 ; NOREF#76.TX 4.21,51.8 5.23,50.78 NOREF#7.TP1 ; IC3.2 7.83,39.88 R6.2 ; D1.1 7.27,24.89 3.05,24.89 NOREF#108.TP1 ; C6.1 NOREF#97.TP1
  Top Layer w1.524: B1.1 B1.2 ; D1.2 2.16,21.97 2.16,18.16 13.95,18.16 JACK1.1 14.99,7.24 26.92,7.24 NOREF#126.VIN ; 18.54,21.97 IC2.1 ; 18.54,21.97 18.54,16.44 C1.1 ; 18.54,21.97 D1.1 ; C2.1 23.62,16.44 IC2.3
  Bottom Layer w0.762: NOREF#102.TP1 7.62,50.81 NOREF#7.TP1
  Bottom Layer w1.016: NOREF#97.TP1 17.45,56.18 B1.2 ; NOREF#11.TP1 6.1,31.12 3.05,31.12 NOREF#108.TP1
GROUND: length 334.9
  Top Layer w0.508: NOREF#23.TP1 NOREF#116.TP1 ; R5.1 16.91,42.07 C3.2 15.67,45.5 B1.4
  Top Layer w0.889: C7.1 8.07,33.15 9.35,34.43 9.35,35.53 10.68,36.86 10.68,40.29 13.72,43.32 15.66,43.32 C3.2 ; C5.2 C8.2 ; IC1.31 59.94,22.99 61.27,21.66 C9.2 ; 57.57,47.67 C4.2
  Top Layer w1.016: 21.13,45.34 21.13,42.04 ; 57.57,46.14 57.57,47.67 ; 28.7,20.51 30.35,18.85 NOREF#72.TP1 ; C1.2 C2.2
  Bottom Layer w0.889: 57.57,52.95 57.4,52.79 NOREF#52.TP1 IC1.11 57.4,35.56 59.94,33.02 IC1.31 ; 57.57,52.95 30.41,52.95 21.13,43.67 ; 57.57,52.95 57.57,57.11 52.32,62.36 NOREF#122.9 NOREF#105.10 NOREF#98.11 NOREF#106.12 NOREF#43.13 NOREF#87.14 NOREF#21.15 ; NOREF#116.TP1 8.92,54.44 NOREF#30.TP1 ; NOREF#35.TP1 6.1,54.36 NOREF#23.TP1 5.11,51.33 5.11,47.98 ; NOREF#10.8 NOREF#5.7 NOREF#75.6 NOREF#94.5 NOREF#81.4 NOREF#80.3 NOREF#40.2 NOREF#73.1 NOREF#103.1 NOREF#2.2 NOREF#50.3 NOREF#113.4 NOREF#17.5 NOREF#38.6 NOREF#120.7 NOREF#19.8 NOREF#51.9 40.26,1.52 37.08,4.7 NOREF#124.GND NOREF#24.GND 34.54,14.1 NOREF#72.TP1 29.71,18.93 21.71,18.93 ; 21.13,43.67 17.53,47.28 B1.4 B1.3 5.81,47.28 5.11,47.98 ; 21.13,43.67 21.08,43.62 IC2.2 21.08,19.56 21.71,18.93 ; JACK1.2 10.95,11.67 JACK1.3 21.22,9.67 NOREF#99.TP1 21.72,18.92 21.71,18.93 ; 5.11,47.98 3.94,49.15 NOREF#92.GND
  Bottom Layer w1.524: NOREF#89.1 NOREF#63.2 NOREF#74.3 NOREF#86.4 NOREF#56.5 NOREF#84.6 NOREF#119.7 NOREF#109.8

## Copper pours and planes (outline as drawn; the poured copper is in the pictures)
GROUND on Bottom Layer: 85.6,0 0,0 0,64.01 85.6,64.01

## Text on the board
Bottom Silkscreen Layer: Revision 2 / ATMEGA1284 / FrogDuino | FROGTRONICS
Top Silkscreen Layer: 5V Switch / <-USB-JACK-> | GND | RTS | RX | TX | 5V | Ground Line | 5V Line | 3V3 | D15 | D16 | D17 | D18 | D19 | D20 | D21 | D22 | D23 | A7 | A6 | A5 | A4 | A3 | A2 | A1 | A0 | D14 | D13 | D12 | D11 | D10 | D9 | D8 | D7 | D6 | D5 | D4 | D2 | D1 | D0 | VIN | D3 | Please give credit to Evan Dueck / If you use it can you / dm me (Froggy814) on forum.arduino.com | 7-16V / Max | FrogDuino R2
